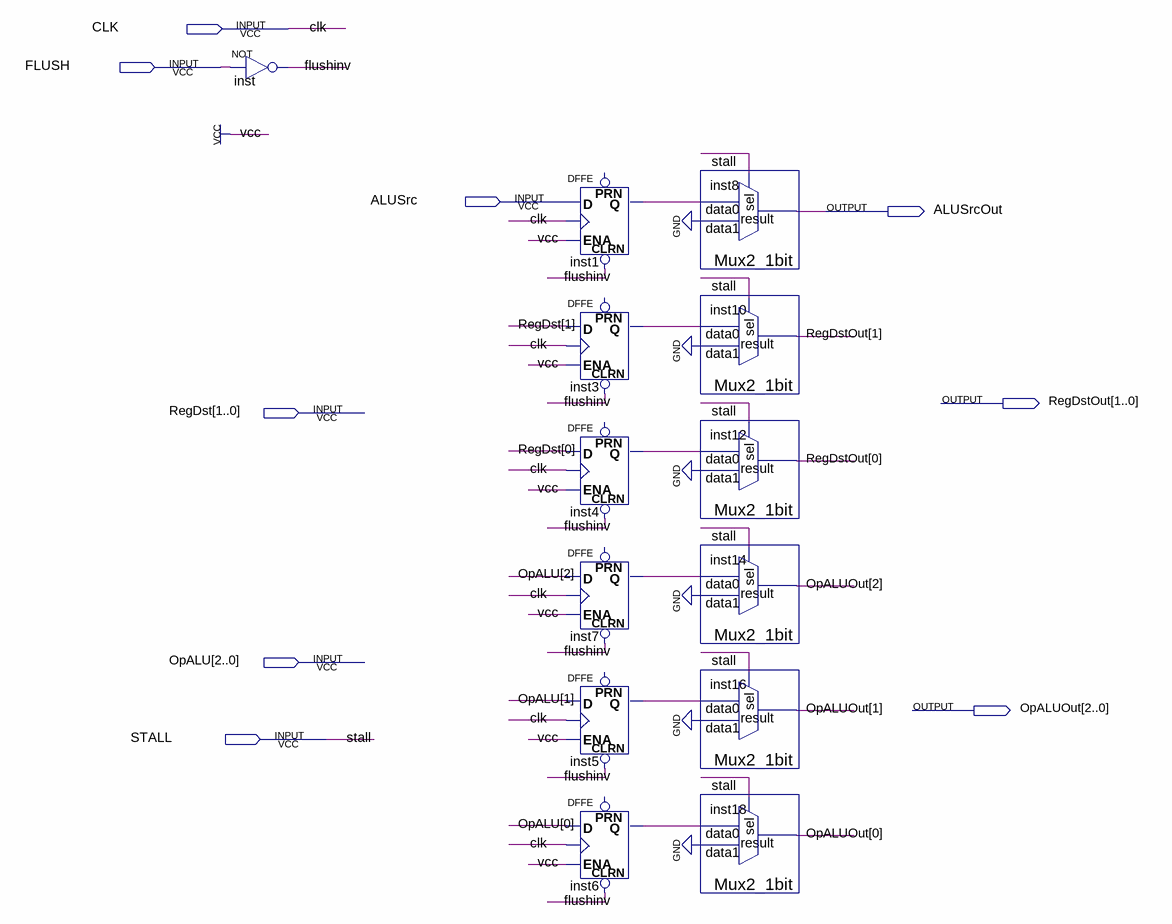
[diagram p0: schematic sheet]
// Quartus schematic EXPipe.bdf as structural Verilog: 13 symbols, 9 pins
module EXPipe (
  input  CLK,
  input  FLUSH,
  input  ALUSrc,
  input  [1:0] RegDst,
  input  [2:0] OpALU,
  input  STALL,
  output ALUSrcOut,
  output [1:0] RegDstOut,
  output [2:0] OpALUOut
);

  wire flushinv, inst1_q, inst3_q, inst4_q, inst5_q, inst6_q, inst7_q;

  not inst (flushinv, FLUSH);
  DFFE inst1 (.CLRN(flushinv), .D(ALUSrc), .CLK(CLK), .ENA(1'b1), .Q(inst1_q));  // open: PRN
  DFFE inst3 (.CLRN(flushinv), .D(RegDst[1]), .CLK(CLK), .ENA(1'b1), .Q(inst3_q));  // open: PRN
  DFFE inst4 (.CLRN(flushinv), .D(RegDst[0]), .CLK(CLK), .ENA(1'b1), .Q(inst4_q));  // open: PRN
  DFFE inst7 (.CLRN(flushinv), .D(OpALU[2]), .CLK(CLK), .ENA(1'b1), .Q(inst7_q));  // open: PRN
  DFFE inst5 (.CLRN(flushinv), .D(OpALU[1]), .CLK(CLK), .ENA(1'b1), .Q(inst5_q));  // open: PRN
  DFFE inst6 (.CLRN(flushinv), .D(OpALU[0]), .CLK(CLK), .ENA(1'b1), .Q(inst6_q));  // open: PRN
  Mux2_1bit inst8 (.data1(1'b0), .data0(inst1_q), .sel(STALL), .result(ALUSrcOut));
  Mux2_1bit inst10 (.data1(1'b0), .data0(inst3_q), .sel(STALL), .result(RegDstOut[1]));
  Mux2_1bit inst12 (.data1(1'b0), .data0(inst4_q), .sel(STALL), .result(RegDstOut[0]));
  Mux2_1bit inst14 (.data1(1'b0), .data0(inst7_q), .sel(STALL), .result(OpALUOut[2]));
  Mux2_1bit inst16 (.data1(1'b0), .data0(inst5_q), .sel(STALL), .result(OpALUOut[1]));
  Mux2_1bit inst18 (.data1(1'b0), .data0(inst6_q), .sel(STALL), .result(OpALUOut[0]));
endmodule
